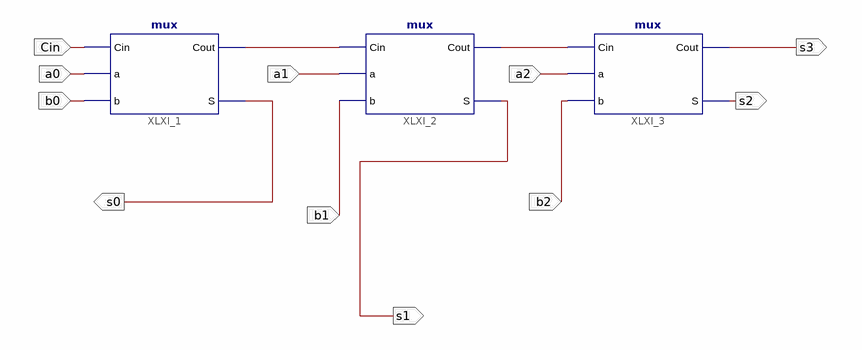
[diagram p0: schematic sheet 1]
// Xilinx ISE schematic Adder.sch (spartan3e) as structural Verilog: 3 symbols, 11 ports
module Adder (
  input  a1,
  input  a2,
  input  b1,
  input  Cin,
  input  a0,
  input  b0,
  input  b2,
  output s2,
  output s0,
  output s3,
  output s1
);

  wire XLXN_1, XLXN_2;

  mux XLXI_1 (.Cin(Cin), .a(a0), .b(b0), .Cout(XLXN_1), .S(s0));
  mux XLXI_2 (.Cin(XLXN_1), .a(a1), .b(b1), .Cout(XLXN_2), .S(s1));
  mux XLXI_3 (.Cin(XLXN_2), .a(a2), .b(b2), .Cout(s3), .S(s2));
endmodule
